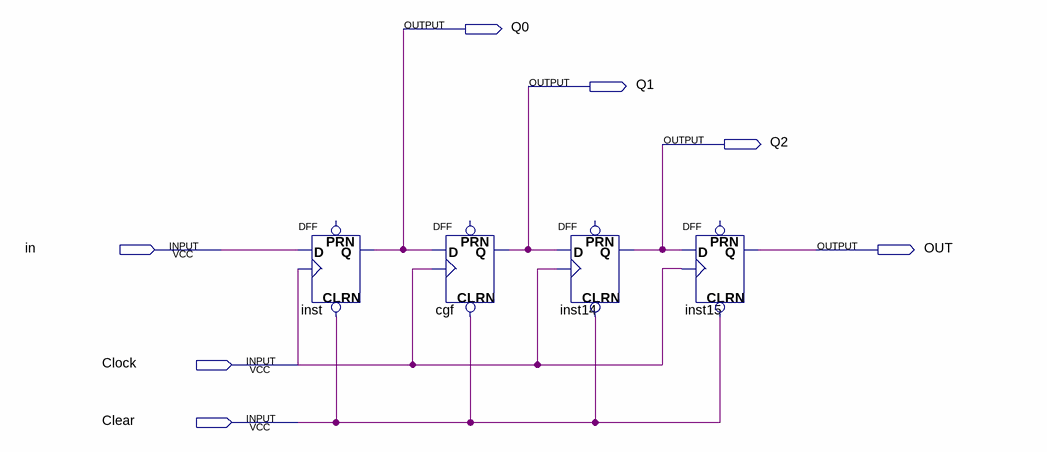
[diagram p0: schematic sheet]
// Quartus schematic Question1.bdf as structural Verilog: 4 symbols, 7 pins
module Question1 (
  input  in,
  input  Clock,
  input  Clear,
  output Q0,
  output Q1,
  output Q2,
  output OUT
);

  DFF inst (.CLRN(Clear), .CLK(Clock), .D(in), .Q(Q0));  // open: PRN
  DFF cgf (.CLRN(Clear), .CLK(Clock), .D(Q0), .Q(Q1));  // open: PRN
  DFF inst14 (.CLRN(Clear), .CLK(Clock), .D(Q1), .Q(Q2));  // open: PRN
  DFF inst15 (.CLRN(Clear), .CLK(Clock), .D(Q2), .Q(OUT));  // open: PRN
endmodule
